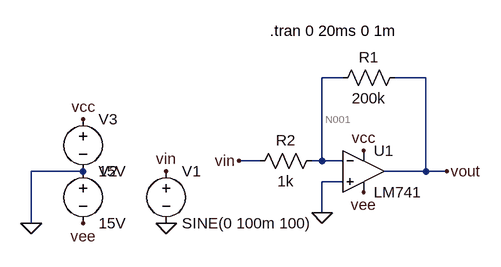
[diagram p0: schematic op_amp.asc]
op_amp.asc, the LTspice schematic file:
Version 4.1
SHEET 1 880 680
WIRE 144 32 112 32
WIRE 272 32 224 32
WIRE 16 160 -16 160
WIRE 112 160 112 32
WIRE 112 160 96 160
WIRE 144 160 112 160
WIRE -256 176 -336 176
WIRE 272 176 272 32
WIRE 272 176 208 176
WIRE 304 176 272 176
WIRE 144 192 112 192
WIRE 112 240 112 192
WIRE -336 256 -336 176
FLAG 112 240 0
FLAG -336 256 0
FLAG -256 96 vcc
FLAG -256 256 vee
FLAG 176 144 vcc
FLAG 176 208 vee
FLAG 304 176 vout
FLAG -128 256 0
FLAG -128 176 vin
FLAG -16 160 vin
SYMBOL res 240 16 R90
WINDOW 0 0 56 VBottom 2
WINDOW 3 32 56 VTop 2
SYMATTR InstName R1
SYMATTR Value 200k
SYMBOL res 112 144 R90
WINDOW 0 0 56 VBottom 2
WINDOW 3 32 56 VTop 2
SYMATTR InstName R2
SYMATTR Value 1k
SYMBOL voltage -256 160 R0
WINDOW 123 0 0 Left 0
WINDOW 39 0 0 Left 0
SYMATTR InstName V2
SYMATTR Value 15V
SYMBOL voltage -256 80 R0
WINDOW 123 0 0 Left 0
WINDOW 39 0 0 Left 0
SYMATTR InstName V3
SYMATTR Value 15V
SYMBOL LM741 176 112 R0
SYMATTR InstName U1
SYMBOL voltage -128 160 R0
WINDOW 123 0 0 Left 0
WINDOW 39 0 0 Left 0
SYMATTR InstName V1
SYMATTR Value SINE(0 100m 100)
TEXT 32 -40 Left 2 !.tran 0 20ms 0 1m

The netlist it stands for:
* op_amp.asc
R1 vout N001 200k
R2 N001 vin 1k
V2 0 vee 15V
V3 vcc 0 15V
X§U1 0 N001 vcc vee vout LM741  ; pins In+ In- V+ V- OUT
V1 vin 0 SINE(0 100m 100)
.tran 0 20ms 0 1m
.lib LM741.lib
.backanno
.end

* Results of the author's LTspice run, read from the files saved beside the schematic
* Operating Point, zero values left out:
*   V(n001) = 998.9 µV
*   V(vee) = -15 V
*   V(vcc) = 15 V
*   V(vout) = 221.2 mV
*   I(R1) = 1.101 µA
*   I(V2) = -1.701 mA
*   I(R2) = 998.9 nA
*   I(V1) = 998.9 nA
*   I(V3) = -1.702 mA
*   Ix(u1:1) = 57.86 nA
*   Ix(u1:2) = 101.9 nA
*   Ix(u1:99) = 1.702 mA
*   Ix(u1:50) = -1.701 mA
*   Ix(u1:28) = -1.101 µA
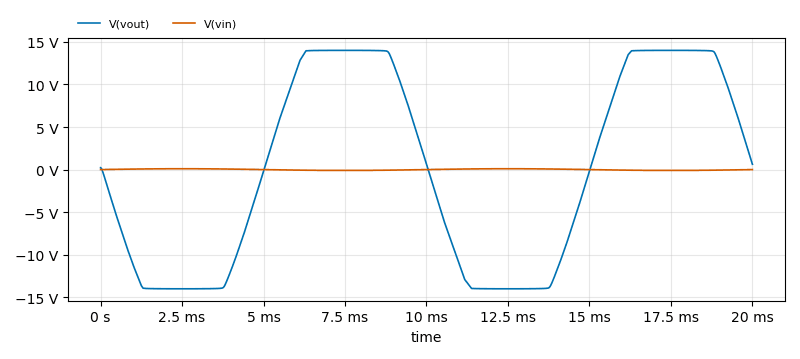
[diagram p1: Transient Analysis of op_amp.asc, plotted from the saved traces]
* Transient Analysis, 1 run:
*   V(vout): min -14 V, max 14 V, average 106.9 mV, rms 11.65 V, last 627.1 mV
*   V(vin): min -100 mV, max 100 mV, average 15.28 µV, rms 70.9 mV, last 0 V